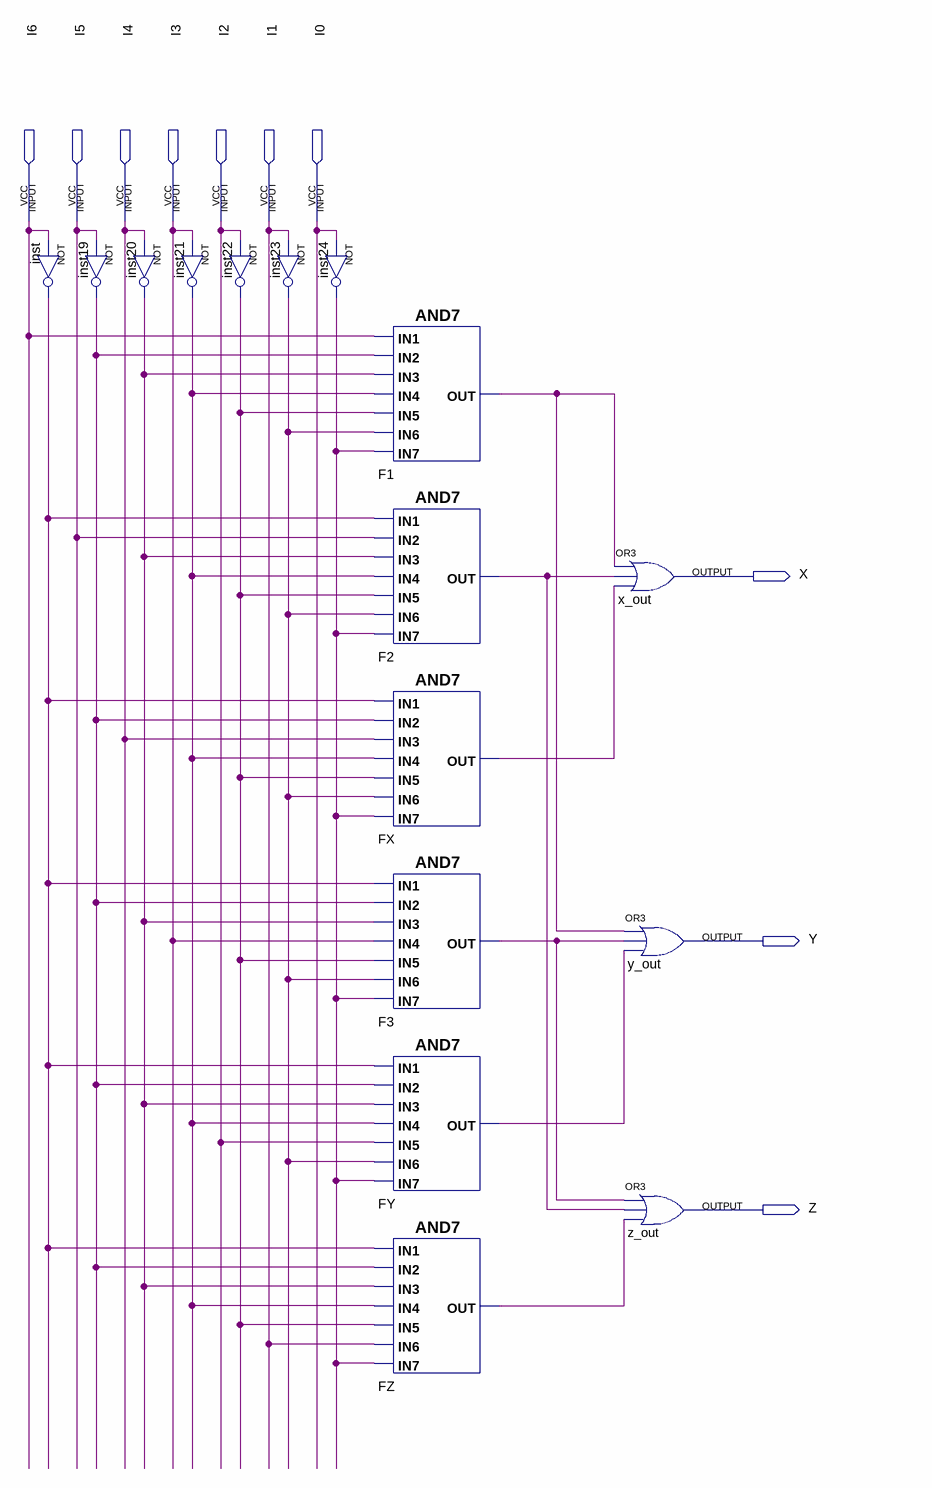
[diagram p0: schematic sheet]
// Quartus schematic ENCODER.bdf as structural Verilog: 16 symbols, 10 pins
module ENCODER (
  input  I6,
  input  I5,
  input  I4,
  input  I3,
  input  I2,
  input  I1,
  input  I0,
  output X,
  output Y,
  output Z
);

  wire F1_out, F2_out, F3_out, FX_out, FY_out, FZ_out, inst19_out, inst20_out, inst21_out, inst22_out,
       inst23_out, inst24_out, inst_out;

  not inst (inst_out, I6);
  not inst19 (inst19_out, I5);
  not inst20 (inst20_out, I4);
  not inst21 (inst21_out, I3);
  not inst22 (inst22_out, I2);
  not inst23 (inst23_out, I1);
  not inst24 (inst24_out, I0);
  and F1 (F1_out, I6, inst19_out, inst20_out, inst21_out, inst22_out, inst23_out, inst24_out);
  and F2 (F2_out, inst_out, I5, inst20_out, inst21_out, inst22_out, inst23_out, inst24_out);
  and FX (FX_out, inst_out, inst19_out, I4, inst21_out, inst22_out, inst23_out, inst24_out);
  and F3 (F3_out, inst_out, inst19_out, inst20_out, I3, inst22_out, inst23_out, inst24_out);
  and FY (FY_out, inst_out, inst19_out, inst20_out, inst21_out, I2, inst23_out, inst24_out);
  and FZ (FZ_out, inst_out, inst19_out, inst20_out, inst21_out, inst22_out, I1, inst24_out);
  or x_out (X, F1_out, F2_out, FX_out);
  or y_out (Y, F1_out, F3_out, FY_out);
  or z_out (Z, F3_out, F2_out, FZ_out);
endmodule
